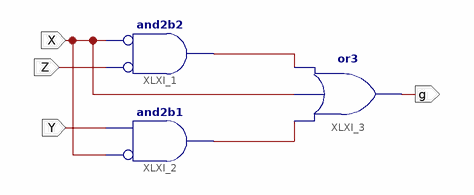
[diagram p0: schematic sheet 1]
// Xilinx ISE schematic circuitoG.sch (spartan3e) as structural Verilog: 3 symbols, 4 ports
module circuitoG (
  input  X,
  input  Y,
  input  Z,
  output g
);

  wire XLXN_6, XLXN_7;

  and XLXI_1 (XLXN_6, ~Z, ~X);  // and2b2
  and XLXI_2 (XLXN_7, ~X, Y);  // and2b1
  or XLXI_3 (g, XLXN_7, X, XLXN_6);
endmodule
